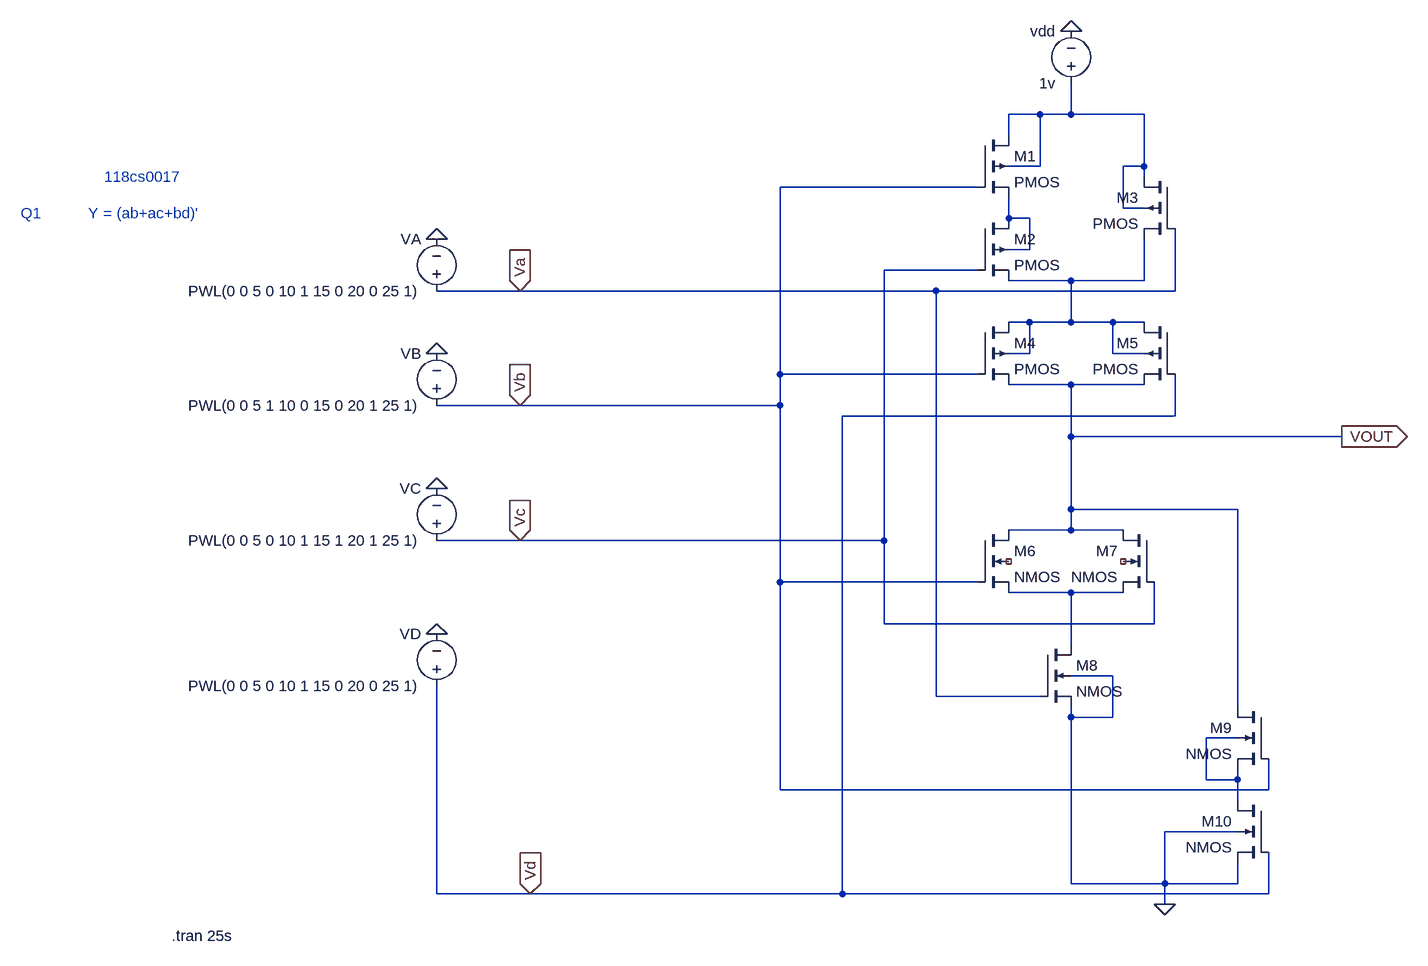
[diagram p0: schematic Draft13.asc]
Draft13.asc, the LTspice schematic file:
Version 4
SHEET 1 880 1296
WIRE 192 16 144 16
WIRE 240 16 240 -32
WIRE 240 16 192 16
WIRE 352 16 240 16
WIRE 144 48 144 16
WIRE 192 96 192 16
WIRE 192 96 144 96
WIRE 352 96 352 16
WIRE 352 96 320 96
WIRE 352 112 352 96
WIRE 96 128 -208 128
WIRE 320 160 320 96
WIRE 352 160 320 160
WIRE 144 176 144 144
WIRE 176 176 144 176
WIRE 176 224 176 176
WIRE 176 224 144 224
WIRE 96 256 -48 256
WIRE 240 272 144 272
WIRE 352 272 352 208
WIRE 352 272 240 272
WIRE -608 288 -736 288
WIRE 32 288 -608 288
WIRE 400 288 400 192
WIRE 400 288 32 288
WIRE 176 336 144 336
WIRE 240 336 240 272
WIRE 240 336 176 336
WIRE 304 336 240 336
WIRE 352 336 304 336
WIRE 176 384 176 336
WIRE 176 384 144 384
WIRE 304 384 304 336
WIRE 352 384 304 384
WIRE -208 416 -208 128
WIRE 96 416 -208 416
WIRE 240 432 144 432
WIRE 352 432 240 432
WIRE -608 464 -736 464
WIRE -208 464 -208 416
WIRE -208 464 -608 464
WIRE 400 480 400 416
WIRE 400 480 -112 480
WIRE 240 512 240 432
WIRE 656 512 240 512
WIRE 240 624 240 512
WIRE 496 624 240 624
WIRE 240 656 240 624
WIRE 240 656 144 656
WIRE 320 656 240 656
WIRE -608 672 -736 672
WIRE -48 672 -48 256
WIRE -48 672 -608 672
WIRE -208 736 -208 464
WIRE 96 736 -208 736
WIRE 240 752 144 752
WIRE 320 752 240 752
WIRE -48 800 -48 672
WIRE 368 800 368 736
WIRE 368 800 -48 800
WIRE 240 832 240 752
WIRE 304 880 240 880
WIRE 32 912 32 288
WIRE 192 912 32 912
WIRE 496 928 496 624
WIRE 240 944 240 928
WIRE 304 944 304 880
WIRE 304 944 240 944
WIRE 496 976 448 976
WIRE 448 1040 448 976
WIRE 496 1040 496 1024
WIRE 496 1040 448 1040
WIRE -208 1056 -208 736
WIRE 544 1056 544 1008
WIRE 544 1056 -208 1056
WIRE 496 1072 496 1040
WIRE 496 1120 384 1120
WIRE 240 1200 240 944
WIRE 384 1200 384 1120
WIRE 384 1200 240 1200
WIRE 496 1200 496 1168
WIRE 496 1200 384 1200
WIRE -736 1216 -736 896
WIRE -592 1216 -736 1216
WIRE -112 1216 -112 480
WIRE -112 1216 -592 1216
WIRE 544 1216 544 1152
WIRE 544 1216 -112 1216
WIRE 384 1232 384 1200
FLAG 240 -112 0
FLAG 384 1232 0
FLAG 656 512 VOUT
IOPIN 656 512 Out
FLAG -736 208 0
FLAG -736 384 0
FLAG -736 592 0
FLAG -736 816 0
FLAG -608 288 Va
IOPIN -608 288 In
FLAG -608 464 Vb
IOPIN -608 464 In
FLAG -608 672 Vc
IOPIN -608 672 In
FLAG -592 1216 Vd
IOPIN -592 1216 In
SYMBOL pmos4 96 48 R0
SYMATTR InstName M1
SYMBOL pmos4 96 176 R0
SYMATTR InstName M2
SYMBOL pmos4 400 112 M0
SYMATTR InstName M3
SYMBOL pmos4 96 336 R0
SYMATTR InstName M4
SYMBOL pmos4 400 336 M0
SYMATTR InstName M5
SYMBOL voltage 240 -16 R180
WINDOW 0 24 96 Left 2
WINDOW 3 24 16 Left 2
SYMATTR InstName vdd
SYMATTR Value 1v
SYMBOL nmos4 96 656 R0
SYMATTR InstName M6
SYMBOL nmos4 368 656 M0
SYMATTR InstName M7
SYMBOL nmos4 192 832 R0
SYMATTR InstName M8
SYMBOL nmos4 544 928 M0
SYMATTR InstName M9
SYMBOL nmos4 544 1072 M0
SYMATTR InstName M10
SYMBOL voltage -736 912 R180
WINDOW 0 24 96 Left 2
WINDOW 3 24 16 Left 2
WINDOW 123 0 0 Left 0
WINDOW 39 0 0 Left 0
SYMATTR InstName VD
SYMATTR Value PWL(0 0 5 0 10 1 15 0 20 0 25 1)
SYMBOL voltage -736 688 R180
WINDOW 0 24 96 Left 2
WINDOW 3 24 16 Left 2
WINDOW 123 0 0 Left 0
WINDOW 39 0 0 Left 0
SYMATTR InstName VC
SYMATTR Value PWL(0 0 5 0 10 1 15 1 20 1 25 1)
SYMBOL voltage -736 480 R180
WINDOW 0 24 96 Left 2
WINDOW 3 24 16 Left 2
WINDOW 123 0 0 Left 0
WINDOW 39 0 0 Left 0
SYMATTR InstName VB
SYMATTR Value PWL(0 0 5 1 10 0 15 0 20 1 25 1)
SYMBOL voltage -736 304 R180
WINDOW 0 24 96 Left 2
WINDOW 3 24 16 Left 2
WINDOW 123 0 0 Left 0
WINDOW 39 0 0 Left 0
SYMATTR InstName VA
SYMATTR Value PWL(0 0 5 0 10 1 15 0 20 0 25 1)
TEXT -1144 1280 Left 2 !.tran 25s
TEXT -1248 112 Left 2 ;118cs0017
TEXT -1272 168 Left 2 ;Y = (ab+ac+bd)'
TEXT -1376 168 Left 2 ;Q1

The netlist it stands for:
* Draft13.asc
M1 N001 Vb N002 N001 PMOS
M2 N002 Vc N003 N002 PMOS
M3 N001 Va N003 N001 PMOS
M4 N003 Vb VOUT N003 PMOS
M5 N003 Vd VOUT N003 PMOS
vdd N001 0 1v
M6 VOUT Vb N004 NC_01 NMOS
M7 VOUT Vc N004 NC_02 NMOS
M8 N004 Va 0 0 NMOS
M9 VOUT Vb N005 N005 NMOS
M10 N005 Vd 0 0 NMOS
VD Vd 0 PWL(0 0 5 0 10 1 15 0 20 0 25 1)
VC Vc 0 PWL(0 0 5 0 10 1 15 1 20 1 25 1)
VB Vb 0 PWL(0 0 5 1 10 0 15 0 20 1 25 1)
VA Va 0 PWL(0 0 5 0 10 1 15 0 20 0 25 1)
.model NMOS NMOS
.model PMOS PMOS
.lib standard.mos
.tran 25s
* 118cs0017
* Y = (ab+ac+bd)'
* Q1
.backanno
.end